# Altium schematic sheet microf4.SchDoc
size A2
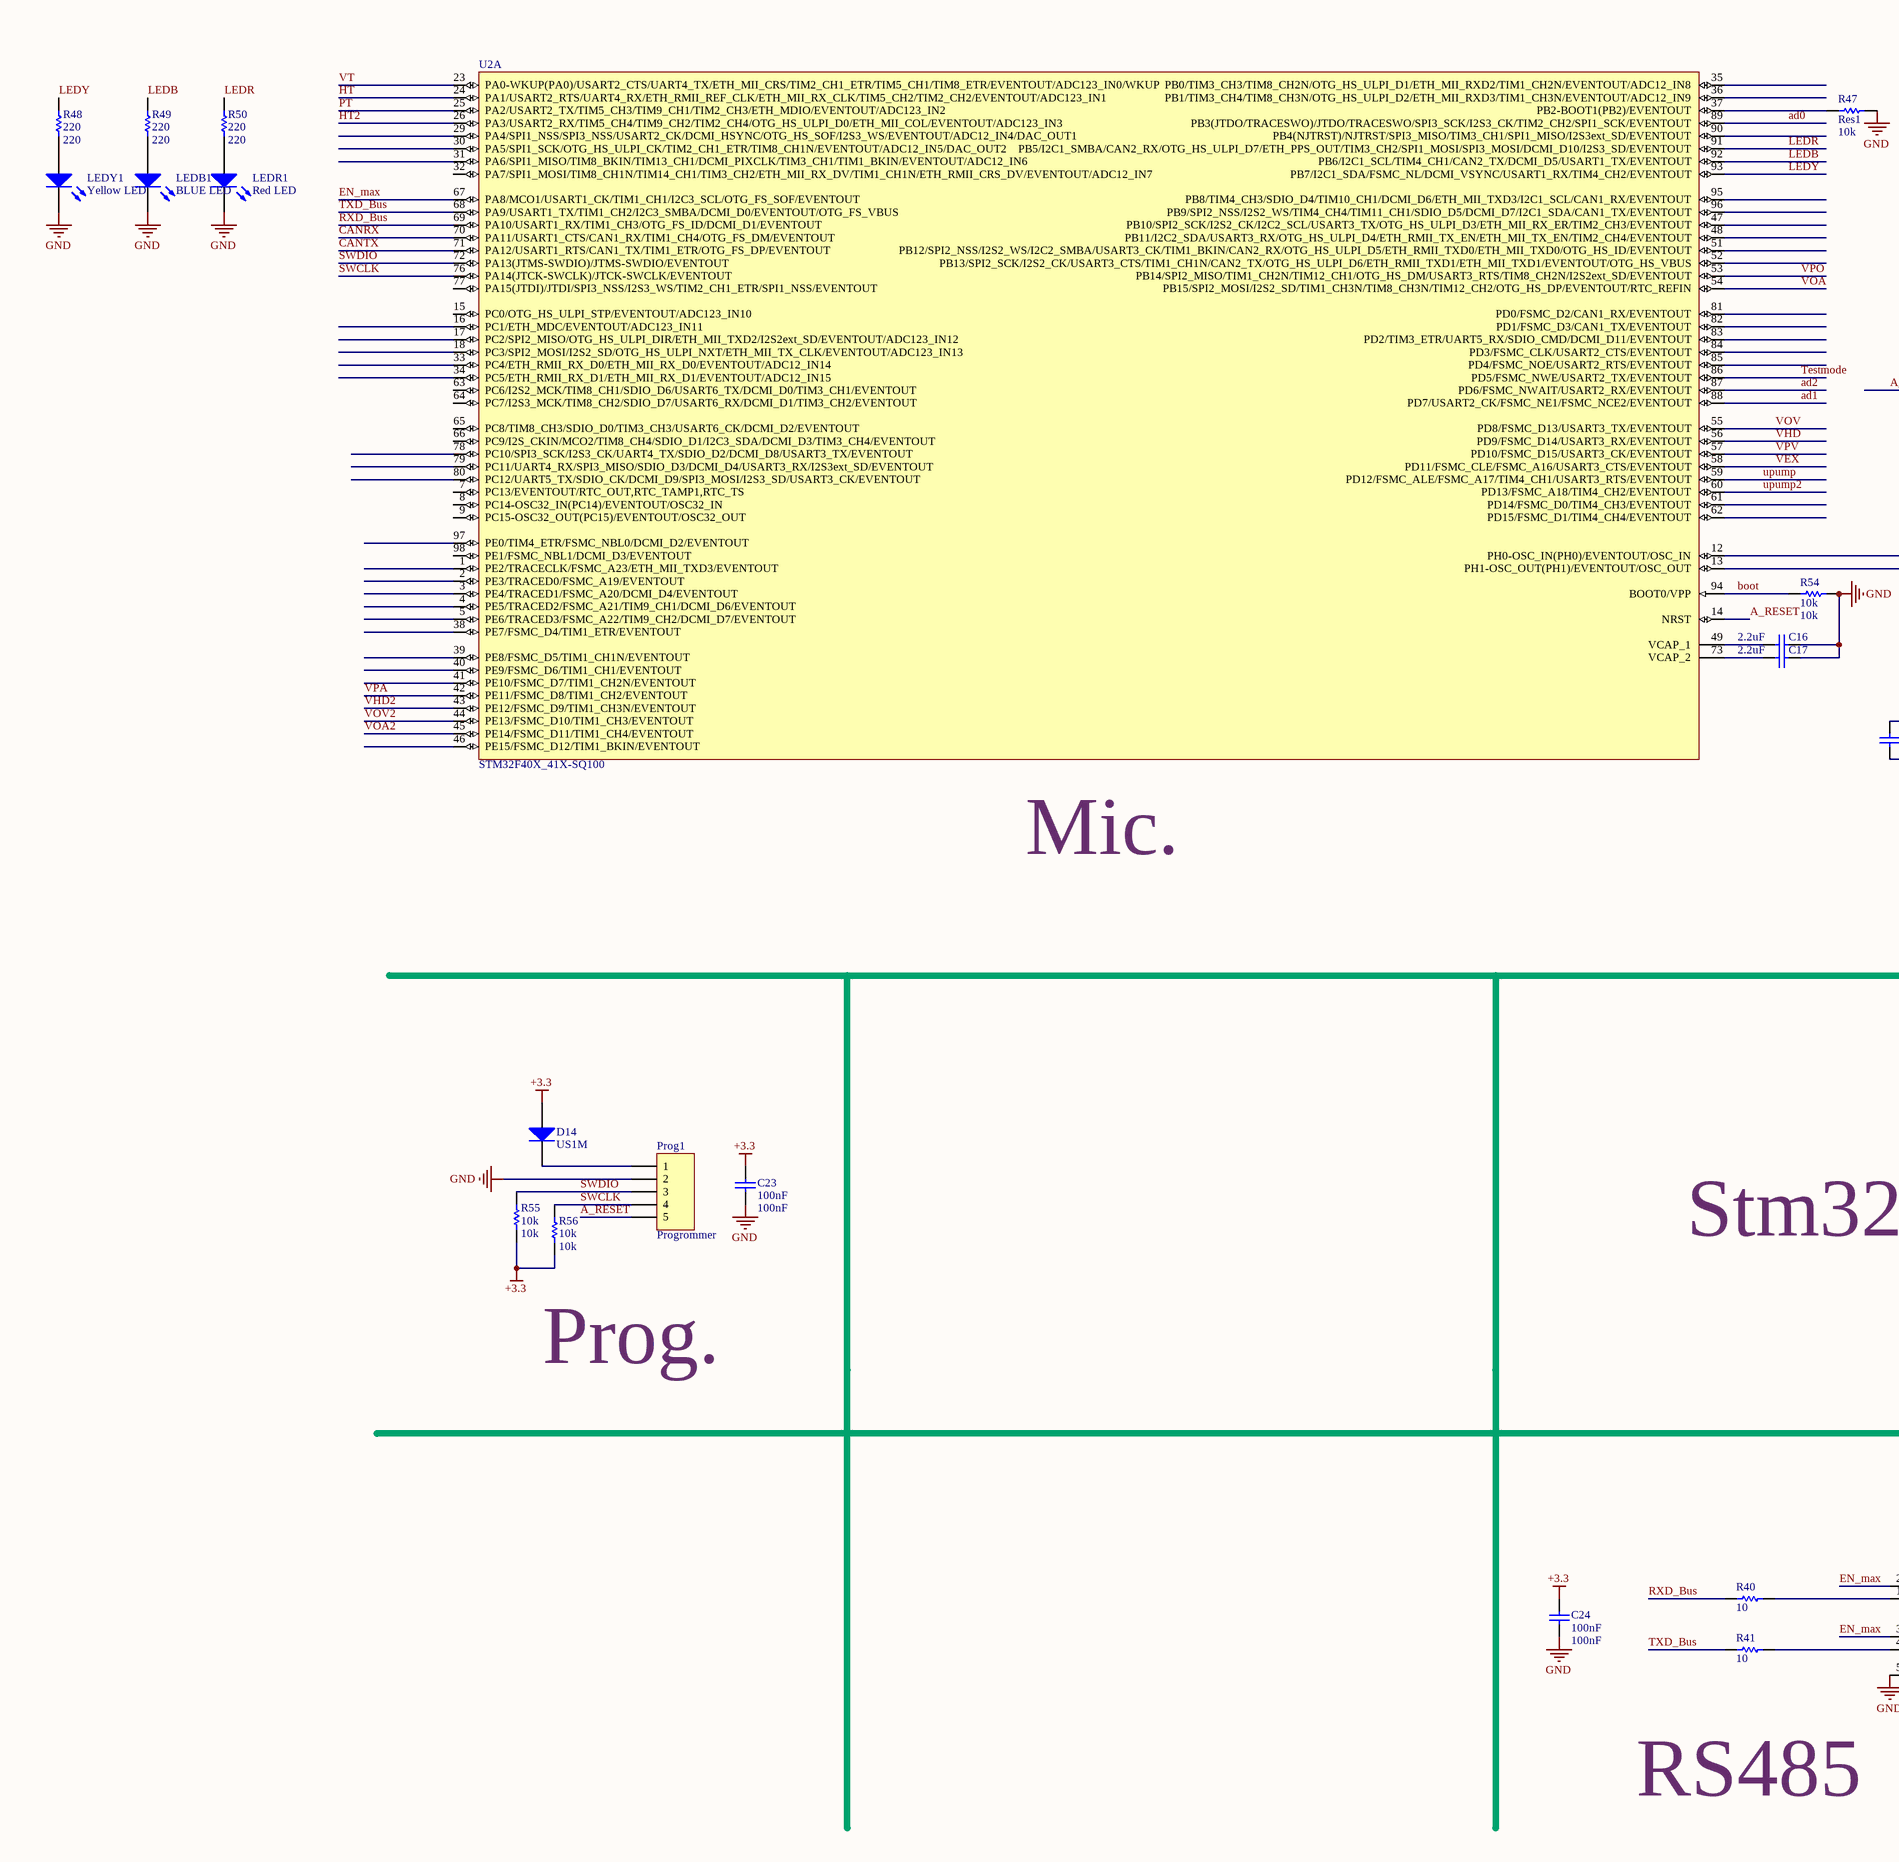
[diagram p0: microf4.SchDoc, left]
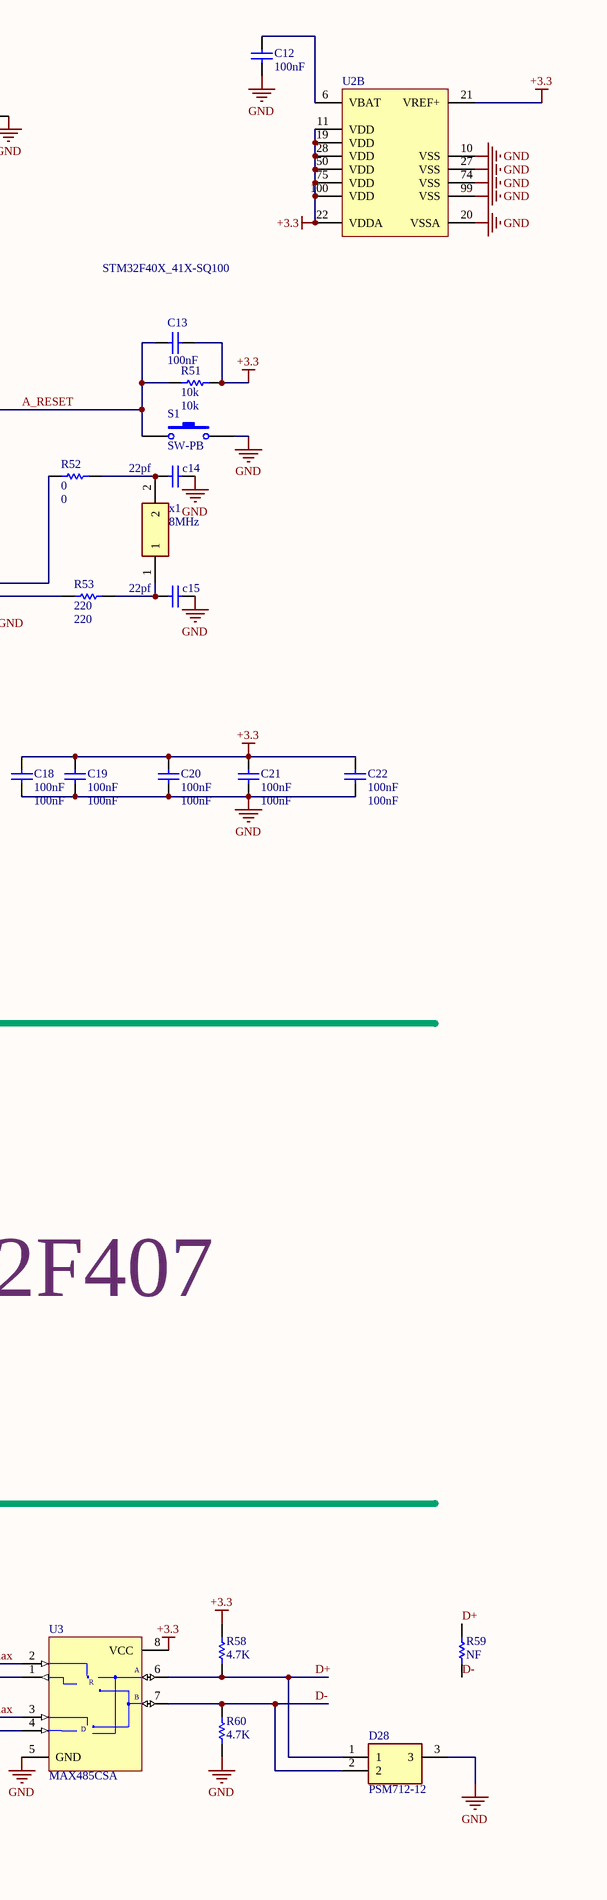
[diagram p1: microf4.SchDoc, right]

## Parts
C12  100nF  [0805]
C13  value 100nF  [0805]
c14  22pf  [0805]
c15  22pf  [0805]
C16  2.2uF  [0805]
C17  2.2uF  [0805]
C18  100nF  [0805]
C19  100nF  [0805]
C20  100nF  [0805]
C21  100nF  [0805]
C22  100nF  [0805]
C23  100nF  [0805]
C24  100nF  [0805]
D14  US1M  [US1M]
D28  PSM712-12  [psm712]
LEDB1  BLUE LED  [3518]
LEDR1  Red LED  [3518]
LEDY1  Yellow LED  [3518]
Prog1  Progrommer  [jp circular 5]
R40  10  [0805]
R41  10  [0805]
R47  Res1  value 10k  [0805]
R48  220  [0805]
R49  220  [0805]
R50  220  [0805]
R51  10k  [0805]
R52  0  [0805]
R53  220  [0805]
R54  10k  [0805]
R55  10k  [0805]
R56  10k  [0805]
R58  4.7K  [0805]
R59  NF  [0805]
R60  4.7K  [0805]
S1  SW-PB  [sw-pb-4p]
U2  STM32F40X_41X-SQ100  [100A_N]  (parts A,B of 2)
U3  MAX485CSA  [NSO8_N]
x1  8MHz  [HC49/4HSMX_1]

## Nets
+3.3: C13.1 C18.2 C19.2 C20.2 C21.2 C22.2 C23.2 C24.2 D14.1(A) R51.2 R55.2 R56.2 R58.1 U2.11(VDD) U2.19(VDD) U2.21(VREF+) U2.22(VDDA) U2.28(VDD) U2.50(VDD) U2.75(VDD) U2.100(VDD) U3.8(VCC)
GND: C12.1 c14.2 c15.2 C16.2 C17.2 C18.1 C19.1 C20.1 C21.1 C22.1 C23.1 C24.1 D28.3 LEDB1.2(K) LEDR1.2(K) LEDY1.2(K) Prog1.2 R47.2 R54.2 R60.2 S1.2 U2.10(VSS) U2.20(VSSA) U2.27(VSS) U2.74(VSS) U2.99(VSS) U3.5(GND)
A_RESET: C13.2 Prog1.5 R51.1 S1.1 U2.14(NRST)
ad0: U2.89(PB3(JTDO/TRACESWO)/JTDO/TRACESWO/SPI3_SCK/I2S3_CK/TIM2_CH2/SPI1_SCK/EVENTOUT)
ad1: U2.88(PD7/USART2_CK/FSMC_NE1/FSMC_NCE2/EVENTOUT)
ad2: U2.87(PD6/FSMC_NWAIT/USART2_RX/EVENTOUT)
boot: R54.1 U2.94(BOOT0/VPP)
CANRX: U2.70(PA11/USART1_CTS/CAN1_RX/TIM1_CH4/OTG_FS_DM/EVENTOUT)
CANTX: U2.71(PA12/USART1_RTS/CAN1_TX/TIM1_ETR/OTG_FS_DP/EVENTOUT)
D+: D28.1 R58.2 R59.1 U3.6(A)
D-: D28.2 R59.2 R60.1 U3.7(B)
EN_max: U2.67(PA8/MCO1/USART1_CK/TIM1_CH1/I2C3_SCL/OTG_FS_SOF/EVENTOUT) U3.2(~{RE}) U3.3(DE)
HT: U2.24(PA1/USART2_RTS/UART4_RX/ETH_RMII_REF_CLK/ETH_MII_RX_CLK/TIM5_CH2/TIM2_CH2/EVENTOUT/ADC123_IN1)
HT2: U2.26(PA3/USART2_RX/TIM5_CH4/TIM9_CH2/TIM2_CH4/OTG_HS_ULPI_D0/ETH_MII_COL/EVENTOUT/ADC123_IN3)
LEDB: R49.1 U2.92(PB6/I2C1_SCL/TIM4_CH1/CAN2_TX/DCMI_D5/USART1_TX/EVENTOUT)
LEDR: R50.1 U2.91(PB5/I2C1_SMBA/CAN2_RX/OTG_HS_ULPI_D7/ETH_PPS_OUT/TIM3_CH2/SPI1_MOSI/SPI3_MOSI/DCMI_D10/I2S3_SD/EVENTOUT)
LEDY: R48.1 U2.93(PB7/I2C1_SDA/FSMC_NL/DCMI_VSYNC/USART1_RX/TIM4_CH2/EVENTOUT)
PT: U2.25(PA2/USART2_TX/TIM5_CH3/TIM9_CH1/TIM2_CH3/ETH_MDIO/EVENTOUT/ADC123_IN2)
RXD_Bus: R40.2 U2.69(PA10/USART1_RX/TIM1_CH3/OTG_FS_ID/DCMI_D1/EVENTOUT)
SWCLK: Prog1.4 R56.1 U2.76(PA14(JTCK-SWCLK)/JTCK-SWCLK/EVENTOUT)
SWDIO: Prog1.3 R55.1 U2.72(PA13(JTMS-SWDIO)/JTMS-SWDIO/EVENTOUT)
Testmode: U2.86(PD5/FSMC_NWE/USART2_TX/EVENTOUT)
TXD_Bus: R41.2 U2.68(PA9/USART1_TX/TIM1_CH2/I2C3_SMBA/DCMI_D0/EVENTOUT/OTG_FS_VBUS)
upump: U2.59(PD12/FSMC_ALE/FSMC_A17/TIM4_CH1/USART3_RTS/EVENTOUT)
upump2: U2.60(PD13/FSMC_A18/TIM4_CH2/EVENTOUT)
VEX: U2.58(PD11/FSMC_CLE/FSMC_A16/USART3_CTS/EVENTOUT)
VHD: U2.56(PD9/FSMC_D14/USART3_RX/EVENTOUT)
VHD2: U2.43(PE12/FSMC_D9/TIM1_CH3N/EVENTOUT)
VOA: U2.54(PB15/SPI2_MOSI/I2S2_SD/TIM1_CH3N/TIM8_CH3N/TIM12_CH2/OTG_HS_DP/EVENTOUT/RTC_REFIN)
VOA2: U2.45(PE14/FSMC_D11/TIM1_CH4/EVENTOUT)
VOV: U2.55(PD8/FSMC_D13/USART3_TX/EVENTOUT)
VOV2: U2.44(PE13/FSMC_D10/TIM1_CH3/EVENTOUT)
VPA: U2.42(PE11/FSMC_D8/TIM1_CH2/EVENTOUT)
VPO: U2.53(PB14/SPI2_MISO/TIM1_CH2N/TIM12_CH1/OTG_HS_DM/USART3_RTS/TIM8_CH2N/I2S2ext_SD/EVENTOUT)
VPV: U2.57(PD10/FSMC_D15/USART3_CK/EVENTOUT)
VT: U2.23(PA0-WKUP(PA0)/USART2_CTS/UART4_TX/ETH_MII_CRS/TIM2_CH1_ETR/TIM5_CH1/TIM8_ETR/EVENTOUT/ADC123_IN0/WKUP)
NetC12_2: C12.2 U2.6(VBAT)
Netc14_1: c14.1 R52.2 x1.2
Netc15_1: c15.1 R53.1 x1.1
NetC16_1: C16.1 U2.49(VCAP_1)
NetC17_1: C17.1 U2.73(VCAP_2)
NetD14_2: D14.2(K) Prog1.1
NetLEDB1_1: LEDB1.1(A) R49.2
NetLEDR1_1: LEDR1.1(A) R50.2
NetLEDY1_1: LEDY1.1(A) R48.2
NetR40_1: R40.1 U3.1(RO)
NetR41_1: R41.1 U3.4(DI)
NetR47_1: R47.1 U2.37(PB2-BOOT1(PB2)/EVENTOUT)
NetR52_1: R52.1 U2.12(PH0-OSC_IN(PH0)/EVENTOUT/OSC_IN)
NetR53_2: R53.2 U2.13(PH1-OSC_OUT(PH1)/EVENTOUT/OSC_OUT)

Not connected (* = marked no-connect by the designer): U2 1(PE2/TRACECLK/FSMC_A23/ETH_MII_TXD3/EVENTOUT) 2(PE3/TRACED0/FSMC_A19/EVENTOUT) 3(PE4/TRACED1/FSMC_A20/DCMI_D4/EVENTOUT) 4(PE5/TRACED2/FSMC_A21/TIM9_CH1/DCMI_D6/EVENTOUT) 5(PE6/TRACED3/FSMC_A22/TIM9_CH2/DCMI_D7/EVENTOUT) 7(PC13/EVENTOUT/RTC_OUT,RTC_TAMP1,RTC_TS) 8(PC14-OSC32_IN(PC14)/EVENTOUT/OSC32_IN) 9(PC15-OSC32_OUT(PC15)/EVENTOUT/OSC32_OUT) 15(PC0/OTG_HS_ULPI_STP/EVENTOUT/ADC123_IN10) 16(PC1/ETH_MDC/EVENTOUT/ADC123_IN11) 17(PC2/SPI2_MISO/OTG_HS_ULPI_DIR/ETH_MII_TXD2/I2S2ext_SD/EVENTOUT/ADC123_IN12) 18(PC3/SPI2_MOSI/I2S2_SD/OTG_HS_ULPI_NXT/ETH_MII_TX_CLK/EVENTOUT/ADC123_IN13) 29(PA4/SPI1_NSS/SPI3_NSS/USART2_CK/DCMI_HSYNC/OTG_HS_SOF/I2S3_WS/EVENTOUT/ADC12_IN4/DAC_OUT1) 30(PA5/SPI1_SCK/OTG_HS_ULPI_CK/TIM2_CH1_ETR/TIM8_CH1N/EVENTOUT/ADC12_IN5/DAC_OUT2) 31(PA6/SPI1_MISO/TIM8_BKIN/TIM13_CH1/DCMI_PIXCLK/TIM3_CH1/TIM1_BKIN/EVENTOUT/ADC12_IN6) 32(PA7/SPI1_MOSI/TIM8_CH1N/TIM14_CH1/TIM3_CH2/ETH_MII_RX_DV/TIM1_CH1N/ETH_RMII_CRS_DV/EVENTOUT/ADC12_IN7) 33(PC4/ETH_RMII_RX_D0/ETH_MII_RX_D0/EVENTOUT/ADC12_IN14) 34(PC5/ETH_RMII_RX_D1/ETH_MII_RX_D1/EVENTOUT/ADC12_IN15) 35(PB0/TIM3_CH3/TIM8_CH2N/OTG_HS_ULPI_D1/ETH_MII_RXD2/TIM1_CH2N/EVENTOUT/ADC12_IN8) 36(PB1/TIM3_CH4/TIM8_CH3N/OTG_HS_ULPI_D2/ETH_MII_RXD3/TIM1_CH3N/EVENTOUT/ADC12_IN9) 38(PE7/FSMC_D4/TIM1_ETR/EVENTOUT) 39(PE8/FSMC_D5/TIM1_CH1N/EVENTOUT) 40(PE9/FSMC_D6/TIM1_CH1/EVENTOUT) 41(PE10/FSMC_D7/TIM1_CH2N/EVENTOUT) 46(PE15/FSMC_D12/TIM1_BKIN/EVENTOUT) 47(PB10/SPI2_SCK/I2S2_CK/I2C2_SCL/USART3_TX/OTG_HS_ULPI_D3/ETH_MII_RX_ER/TIM2_CH3/EVENTOUT) 48(PB11/I2C2_SDA/USART3_RX/OTG_HS_ULPI_D4/ETH_RMII_TX_EN/ETH_MII_TX_EN/TIM2_CH4/EVENTOUT) 51(PB12/SPI2_NSS/I2S2_WS/I2C2_SMBA/USART3_CK/TIM1_BKIN/CAN2_RX/OTG_HS_ULPI_D5/ETH_RMII_TXD0/ETH_MII_TXD0/OTG_HS_ID/EVENTOUT) 52(PB13/SPI2_SCK/I2S2_CK/USART3_CTS/TIM1_CH1N/CAN2_TX/OTG_HS_ULPI_D6/ETH_RMII_TXD1/ETH_MII_TXD1/EVENTOUT/OTG_HS_VBUS) 61(PD14/FSMC_D0/TIM4_CH3/EVENTOUT) 62(PD15/FSMC_D1/TIM4_CH4/EVENTOUT) 63(PC6/I2S2_MCK/TIM8_CH1/SDIO_D6/USART6_TX/DCMI_D0/TIM3_CH1/EVENTOUT) 64(PC7/I2S3_MCK/TIM8_CH2/SDIO_D7/USART6_RX/DCMI_D1/TIM3_CH2/EVENTOUT) 65(PC8/TIM8_CH3/SDIO_D0/TIM3_CH3/USART6_CK/DCMI_D2/EVENTOUT) 66(PC9/I2S_CKIN/MCO2/TIM8_CH4/SDIO_D1/I2C3_SDA/DCMI_D3/TIM3_CH4/EVENTOUT) 77(PA15(JTDI)/JTDI/SPI3_NSS/I2S3_WS/TIM2_CH1_ETR/SPI1_NSS/EVENTOUT) 78(PC10/SPI3_SCK/I2S3_CK/UART4_TX/SDIO_D2/DCMI_D8/USART3_TX/EVENTOUT) 79(PC11/UART4_RX/SPI3_MISO/SDIO_D3/DCMI_D4/USART3_RX/I2S3ext_SD/EVENTOUT) 80(PC12/UART5_TX/SDIO_CK/DCMI_D9/SPI3_MOSI/I2S3_SD/USART3_CK/EVENTOUT) 81(PD0/FSMC_D2/CAN1_RX/EVENTOUT) 82(PD1/FSMC_D3/CAN1_TX/EVENTOUT) 83(PD2/TIM3_ETR/UART5_RX/SDIO_CMD/DCMI_D11/EVENTOUT) 84(PD3/FSMC_CLK/USART2_CTS/EVENTOUT) 85(PD4/FSMC_NOE/USART2_RTS/EVENTOUT) 90(PB4(NJTRST)/NJTRST/SPI3_MISO/TIM3_CH1/SPI1_MISO/I2S3ext_SD/EVENTOUT) 95(PB8/TIM4_CH3/SDIO_D4/TIM10_CH1/DCMI_D6/ETH_MII_TXD3/I2C1_SCL/CAN1_RX/EVENTOUT) 96(PB9/SPI2_NSS/I2S2_WS/TIM4_CH4/TIM11_CH1/SDIO_D5/DCMI_D7/I2C1_SDA/CAN1_TX/EVENTOUT) 97(PE0/TIM4_ETR/FSMC_NBL0/DCMI_D2/EVENTOUT) 98(PE1/FSMC_NBL1/DCMI_D3/EVENTOUT)

## Notes on the sheet
- (near U2) Mic.
- Stm32F407
- Prog.
- RS485
- (in symbol MAX485CSA) R; D

## Library data of the parts
C12 C24 = Cap: Capacitor; Published: 8-Jun-2000; LatestRevisionDate: 17-Jul-2002; LatestRevisionNote: Re-released for DXP Platform.; PackageReference: RAD-0.3; Publisher: Altium Limited; Value: 100nF
C13 C18-C23 = Cap: Capacitor; Manufacturer: Generic Components; Class: Passive; Published: 08/06/2000; Publisher: Altium Hobart Technology Centre; SubClass: Capacitor
  C18-C23: Value: 100nF
c14 c15 C16 C17 = Cap_UP: Capacitor; Published: 8-Jun-2000; LatestRevisionDate: 17-Jul-2002; LatestRevisionNote: Re-released for DXP Platform.; PackageReference: RAD-0.3; Publisher: Altium Limited
  c14 c15: Value: 22pf
  C16 C17: Value: 2.2uF
D14 = Diode: 1 Amp General Purpose Rectifier; Revision 1: 11-Jul-2000: SIM Model Added.; Revision 2: 17-Jul-2002: Re-released for DXP Platform.; Package Information: Latest Revision: Aug-1999; Code - JEDEC: DO-204-AL; Published: 8-Jun-2000; Datasheet: Latest Revision: 1998; Package Reference: DO-41; Publisher: Altium Limited
D28 = PSM712-12: TVS Diode (Bi-directional); Manufacturer_Name: ProTek Devices; Datasheet Link: http://www.protekdevices.com/xyz/documents/datasheets/psm712.pdf; Height: 1.21mm; Manufacturer_Part_Number: PSM712-12
LEDB1 LEDR1 LEDY1 = LED3: Typical BLUE SiC LED; pin to pad: 1>2 2>1; Published: 8-Jun-2000; LatestRevisionDate: 17-Dec-2003; LatestRevisionNote: PCB Footprint replaced.; DatasheetDocument: 16-Apr-2002; PackageDocument: 16-Apr-2002; PackageReference: 3.5X2.8X1.9; Publisher: Altium Limited
Prog1 = Header 5: Header, 5-Pin; LatestRevisionDate: 17-Jul-2002; LatestRevisionNote: Re-released for DXP Platform.; Publisher: Altium Limited
R40 R41 R47-R54 R58-R60 = Res1: Resistor; Published: 8-Jun-2000; LatestRevisionDate: 17-Jul-2002; LatestRevisionNote: Re-released for DXP Platform.; PackageReference: AXIAL-0.3; Publisher: Altium Limited
  R40 R41: Value: 10
  R48-R50 R53: Value: 220
  R51 R54: Value: 10k
  R52: Value: 0
  R58 R60: Value: 4.7K
  R59: Value: NF
R55 R56 = Res: Semiconductor Resistor; Published: 8-Jun-2000; LatestRevisionDate: 17-Jul-2002; LatestRevisionNote: Re-released for DXP Platform.; PackageReference: AXIAL-0.5; Publisher: Altium Limited; Value: 10k
S1 = SW-PB: Switch; Published: 24-Mar-1999; LatestRevisionDate: 17-Jul-2002; LatestRevisionNote: Re-released for DXP Platform.; PackageReference: SPST-2; Publisher: Altium Limited
U3 = MAX485CSA: Low-Power, Slew-Rate-Limited RS-485/RS-422 Transceiver; Published: 16-Jan-2001; LatestRevisionDate: 13-Apr-2006; LatestRevisionNote: IPC-7351 Footprint Added.; DatasheetVersion: Feb-1996; PackageReference: NSO8; Publisher: Altium Limited; PackageDescription: 8-Pin Small Outline Integrated Circuit 1.27 mm Pitch; Code_JEDEC: MS-012-AA; Code_IPC: SOIC127P600-8; ComponentLink1Description: Manufacturer Link; ComponentLink1URL: http://www.maxim-ic.com/; ComponentLink2Description: Datasheet; ComponentLink2URL: http://pdfserv.maxim-ic.com/en/ds/MAX1487-MAX491.pdf
x1 = 20.0MHz_HC49_4HSMX_30_50_-40+85C_30pF: Crystal or Oscillator; Manufacturer_Name: IQD; Manufacturer_Part_Number: 20.0MHz HC49/4HSMX 30/50/-40+85°C/30pF; Datasheet Link: http://docs-emea.rs-online.com/webdocs/12fa/0900766b812fa555.pdf